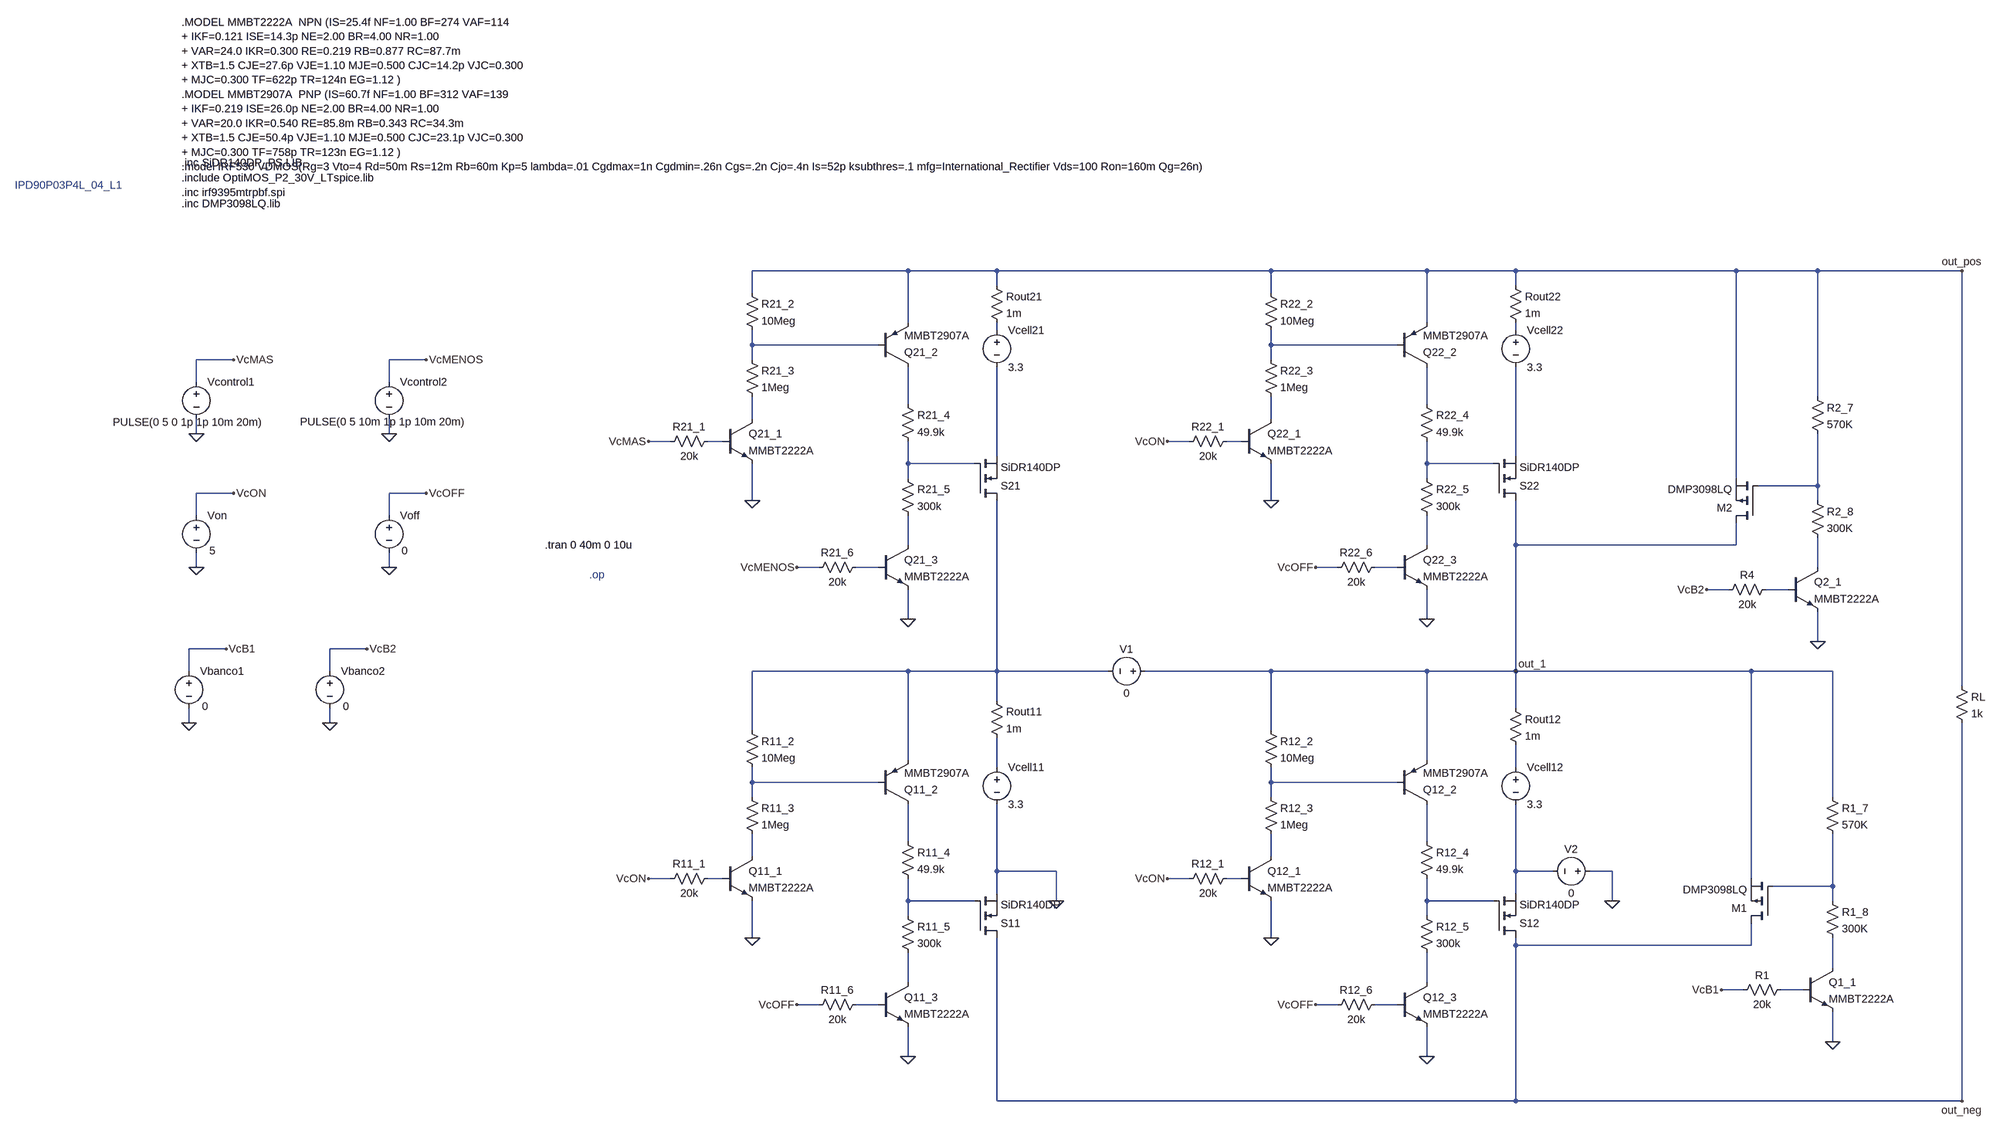
[diagram p0: schematic Switch Matriz_con pmos.asc]
Switch Matriz_con pmos.asc, the LTspice schematic file:
Version 4
SHEET 1 3872 1360
WIRE -592 -1232 -928 -1232
WIRE -400 -1232 -592 -1232
WIRE 192 -1232 -400 -1232
WIRE 528 -1232 192 -1232
WIRE 720 -1232 528 -1232
WIRE 1216 -1232 720 -1232
WIRE 1392 -1232 1216 -1232
WIRE 2800 -1232 1392 -1232
WIRE -400 -1200 -400 -1232
WIRE 720 -1200 720 -1232
WIRE -928 -1184 -928 -1232
WIRE 192 -1184 192 -1232
WIRE -592 -1120 -592 -1232
WIRE 528 -1120 528 -1232
WIRE -400 -1104 -400 -1120
WIRE 720 -1104 720 -1120
WIRE -928 -1072 -928 -1104
WIRE -656 -1072 -928 -1072
WIRE 192 -1072 192 -1104
WIRE 464 -1072 192 -1072
WIRE -2048 -1040 -2128 -1040
WIRE -1632 -1040 -1712 -1040
WIRE -928 -1040 -928 -1072
WIRE 192 -1040 192 -1072
WIRE -2128 -992 -2128 -1040
WIRE -1712 -992 -1712 -1040
WIRE 1392 -960 1392 -1232
WIRE -592 -944 -592 -1024
WIRE 528 -944 528 -1024
WIRE -928 -912 -928 -960
WIRE 192 -912 192 -960
WIRE -2128 -880 -2128 -912
WIRE -1712 -880 -1712 -912
WIRE -1104 -864 -1152 -864
WIRE -992 -864 -1024 -864
WIRE 16 -864 -32 -864
WIRE 128 -864 96 -864
WIRE -400 -832 -400 -1024
WIRE 720 -832 720 -1024
WIRE -592 -816 -592 -864
WIRE -448 -816 -592 -816
WIRE 528 -816 528 -864
WIRE 672 -816 528 -816
WIRE -592 -784 -592 -816
WIRE 528 -784 528 -816
WIRE 1216 -784 1216 -1232
WIRE 1392 -768 1392 -880
WIRE 1392 -768 1264 -768
WIRE -2048 -752 -2128 -752
WIRE -1632 -752 -1712 -752
WIRE -928 -736 -928 -816
WIRE 192 -736 192 -816
WIRE 1392 -736 1392 -768
WIRE -2128 -704 -2128 -752
WIRE -1712 -704 -1712 -752
WIRE -592 -640 -592 -704
WIRE 528 -640 528 -704
WIRE 720 -640 720 -736
WIRE 1216 -640 1216 -688
WIRE 1216 -640 720 -640
WIRE -2128 -592 -2128 -624
WIRE -1712 -592 -1712 -624
WIRE -784 -592 -832 -592
WIRE -656 -592 -704 -592
WIRE 336 -592 288 -592
WIRE 464 -592 416 -592
WIRE 1392 -592 1392 -656
WIRE 1200 -544 1152 -544
WIRE 1328 -544 1280 -544
WIRE -592 -480 -592 -544
WIRE 528 -480 528 -544
WIRE 1392 -432 1392 -496
WIRE -2064 -416 -2144 -416
WIRE -1760 -416 -1840 -416
WIRE -2144 -368 -2144 -416
WIRE -1840 -368 -1840 -416
WIRE -592 -368 -928 -368
WIRE -400 -368 -400 -736
WIRE -400 -368 -592 -368
WIRE -160 -368 -400 -368
WIRE 192 -368 -80 -368
WIRE 528 -368 192 -368
WIRE 720 -368 720 -640
WIRE 720 -368 528 -368
WIRE 1248 -368 720 -368
WIRE 1424 -368 1248 -368
WIRE 2800 -336 2800 -1232
WIRE -400 -304 -400 -368
WIRE 720 -288 720 -368
WIRE -2144 -256 -2144 -288
WIRE -1840 -256 -1840 -288
WIRE -928 -240 -928 -368
WIRE 192 -240 192 -368
WIRE -592 -176 -592 -368
WIRE 528 -176 528 -368
WIRE -400 -160 -400 -224
WIRE 720 -160 720 -208
WIRE -928 -128 -928 -160
WIRE -656 -128 -928 -128
WIRE 192 -128 192 -160
WIRE 464 -128 192 -128
WIRE -928 -96 -928 -128
WIRE 192 -96 192 -128
WIRE 1424 -96 1424 -368
WIRE -592 0 -592 -80
WIRE 528 0 528 -80
WIRE -928 32 -928 -16
WIRE 192 32 192 -16
WIRE -400 64 -400 -80
WIRE -272 64 -400 64
WIRE 720 64 720 -80
WIRE 800 64 720 64
WIRE 928 64 880 64
WIRE -1104 80 -1152 80
WIRE -992 80 -1024 80
WIRE 16 80 -32 80
WIRE 128 80 96 80
WIRE 1248 80 1248 -368
WIRE 1424 96 1424 -16
WIRE 1424 96 1296 96
WIRE -400 112 -400 64
WIRE 720 112 720 64
WIRE -592 128 -592 80
WIRE -448 128 -592 128
WIRE -272 128 -272 64
WIRE 528 128 528 80
WIRE 672 128 528 128
WIRE 928 128 928 64
WIRE 1424 128 1424 96
WIRE -592 160 -592 128
WIRE 528 160 528 128
WIRE -928 208 -928 128
WIRE 192 208 192 128
WIRE 720 224 720 208
WIRE 1248 224 1248 176
WIRE 1248 224 720 224
WIRE 1424 272 1424 208
WIRE -592 304 -592 240
WIRE 528 304 528 240
WIRE 1232 320 1184 320
WIRE 1360 320 1312 320
WIRE -784 352 -832 352
WIRE -656 352 -704 352
WIRE 336 352 288 352
WIRE 464 352 416 352
WIRE 1424 432 1424 368
WIRE -592 464 -592 400
WIRE 528 464 528 400
WIRE -400 560 -400 208
WIRE 720 560 720 224
WIRE 720 560 -400 560
WIRE 2800 560 2800 -256
WIRE 2800 560 720 560
FLAG -928 208 0
FLAG -592 464 0
FLAG -272 128 0
FLAG 192 208 0
FLAG 528 464 0
FLAG 928 128 0
FLAG -928 -736 0
FLAG -592 -480 0
FLAG 192 -736 0
FLAG 528 -480 0
FLAG -2128 -880 0
FLAG -1712 -880 0
FLAG -2048 -1040 VcMAS
FLAG -1632 -1040 VcMENOS
FLAG -1712 -592 0
FLAG -1632 -752 VcOFF
FLAG -2128 -592 0
FLAG -2048 -752 VcON
FLAG -832 352 VcOFF
FLAG -832 -592 VcMENOS
FLAG 288 -592 VcOFF
FLAG 288 352 VcOFF
FLAG -1152 80 VcON
FLAG -1152 -864 VcMAS
FLAG -32 -864 VcON
FLAG -32 80 VcON
FLAG 2800 -1232 out_pos
FLAG 2800 560 out_neg
FLAG 720 -368 out_1
FLAG 1424 432 0
FLAG 1184 320 VcB1
FLAG 1392 -432 0
FLAG 1152 -544 VcB2
FLAG -2064 -416 VcB1
FLAG -2144 -256 0
FLAG -1760 -416 VcB2
FLAG -1840 -256 0
SYMBOL npn -656 304 R0
SYMATTR InstName Q11_3
SYMATTR Value MMBT2222A
SYMBOL res -608 144 R0
SYMATTR InstName R11_5
SYMATTR Value 300k
SYMBOL res -608 -16 R0
SYMATTR InstName R11_4
SYMATTR Value 49.9k
SYMBOL npn -992 32 R0
SYMATTR InstName Q11_1
SYMATTR Value MMBT2222A
SYMBOL res -944 -112 R0
SYMATTR InstName R11_3
SYMATTR Value 1Meg
SYMBOL res -944 -256 R0
SYMATTR InstName R11_2
SYMATTR Value 10Meg
SYMBOL res -688 336 R90
WINDOW 0 0 56 VBottom 2
WINDOW 3 32 56 VTop 2
SYMATTR InstName R11_6
SYMATTR Value 20k
SYMBOL voltage -400 -176 R0
WINDOW 123 0 0 Left 0
WINDOW 39 0 0 Left 0
SYMATTR InstName Vcell11
SYMATTR Value 3.3
SYMBOL pnp -656 -80 M180
SYMATTR InstName Q11_2
SYMATTR Value MMBT2907A
SYMBOL nmos -448 208 M180
SYMATTR InstName S11
SYMATTR Value SiDR140DP
SYMATTR Prefix X
SYMBOL npn 464 304 R0
SYMATTR InstName Q12_3
SYMATTR Value MMBT2222A
SYMBOL res 512 144 R0
SYMATTR InstName R12_5
SYMATTR Value 300k
SYMBOL res 512 -16 R0
SYMATTR InstName R12_4
SYMATTR Value 49.9k
SYMBOL npn 128 32 R0
SYMATTR InstName Q12_1
SYMATTR Value MMBT2222A
SYMBOL res 176 -112 R0
SYMATTR InstName R12_3
SYMATTR Value 1Meg
SYMBOL res 176 -256 R0
SYMATTR InstName R12_2
SYMATTR Value 10Meg
SYMBOL res 432 336 R90
WINDOW 0 0 56 VBottom 2
WINDOW 3 32 56 VTop 2
SYMATTR InstName R12_6
SYMATTR Value 20k
SYMBOL voltage 720 -176 R0
WINDOW 123 0 0 Left 0
WINDOW 39 0 0 Left 0
SYMATTR InstName Vcell12
SYMATTR Value 3.3
SYMBOL pnp 464 -80 M180
SYMATTR InstName Q12_2
SYMATTR Value MMBT2907A
SYMBOL nmos 672 208 M180
SYMATTR InstName S12
SYMATTR Value SiDR140DP
SYMATTR Prefix X
SYMBOL npn -656 -640 R0
SYMATTR InstName Q21_3
SYMATTR Value MMBT2222A
SYMBOL res -608 -800 R0
SYMATTR InstName R21_5
SYMATTR Value 300k
SYMBOL res -608 -960 R0
SYMATTR InstName R21_4
SYMATTR Value 49.9k
SYMBOL npn -992 -912 R0
SYMATTR InstName Q21_1
SYMATTR Value MMBT2222A
SYMBOL res -944 -1056 R0
SYMATTR InstName R21_3
SYMATTR Value 1Meg
SYMBOL res -944 -1200 R0
SYMATTR InstName R21_2
SYMATTR Value 10Meg
SYMBOL res -688 -608 R90
WINDOW 0 0 56 VBottom 2
WINDOW 3 32 56 VTop 2
SYMATTR InstName R21_6
SYMATTR Value 20k
SYMBOL voltage -400 -1120 R0
WINDOW 123 0 0 Left 0
WINDOW 39 0 0 Left 0
SYMATTR InstName Vcell21
SYMATTR Value 3.3
SYMBOL pnp -656 -1024 M180
SYMATTR InstName Q21_2
SYMATTR Value MMBT2907A
SYMBOL nmos -448 -736 M180
SYMATTR InstName S21
SYMATTR Value SiDR140DP
SYMATTR Prefix X
SYMBOL npn 464 -640 R0
SYMATTR InstName Q22_3
SYMATTR Value MMBT2222A
SYMBOL res 512 -800 R0
SYMATTR InstName R22_5
SYMATTR Value 300k
SYMBOL res 512 -960 R0
SYMATTR InstName R22_4
SYMATTR Value 49.9k
SYMBOL npn 128 -912 R0
SYMATTR InstName Q22_1
SYMATTR Value MMBT2222A
SYMBOL res 176 -1056 R0
SYMATTR InstName R22_3
SYMATTR Value 1Meg
SYMBOL res 176 -1200 R0
SYMATTR InstName R22_2
SYMATTR Value 10Meg
SYMBOL res 432 -608 R90
WINDOW 0 0 56 VBottom 2
WINDOW 3 32 56 VTop 2
SYMATTR InstName R22_6
SYMATTR Value 20k
SYMBOL voltage 720 -1120 R0
WINDOW 123 0 0 Left 0
WINDOW 39 0 0 Left 0
SYMATTR InstName Vcell22
SYMATTR Value 3.3
SYMBOL pnp 464 -1024 M180
SYMATTR InstName Q22_2
SYMATTR Value MMBT2907A
SYMBOL nmos 672 -736 M180
SYMATTR InstName S22
SYMATTR Value SiDR140DP
SYMATTR Prefix X
SYMBOL voltage -2128 -1008 R0
WINDOW 3 -180 103 Left 2
WINDOW 123 0 0 Left 0
WINDOW 39 0 0 Left 0
SYMATTR Value PULSE(0 5 0 1p 1p 10m 20m)
SYMATTR InstName Vcontrol1
SYMBOL voltage -1712 -1008 R0
WINDOW 3 -192 102 Left 2
WINDOW 123 0 0 Left 0
WINDOW 39 0 0 Left 0
SYMATTR Value PULSE(0 5 10m 1p 1p 10m 20m)
SYMATTR InstName Vcontrol2
SYMBOL voltage -1712 -720 R0
WINDOW 3 27 92 Left 2
WINDOW 123 0 0 Left 0
WINDOW 39 0 0 Left 0
SYMATTR Value 0
SYMATTR InstName Voff
SYMBOL voltage -2128 -720 R0
WINDOW 3 28 92 Left 2
WINDOW 123 0 0 Left 0
WINDOW 39 0 0 Left 0
SYMATTR Value 5
SYMATTR InstName Von
SYMBOL res -1008 64 R90
WINDOW 0 0 56 VBottom 2
WINDOW 3 32 56 VTop 2
SYMATTR InstName R11_1
SYMATTR Value 20k
SYMBOL res -1008 -880 R90
WINDOW 0 0 56 VBottom 2
WINDOW 3 32 56 VTop 2
SYMATTR InstName R21_1
SYMATTR Value 20k
SYMBOL res 112 -880 R90
WINDOW 0 0 56 VBottom 2
WINDOW 3 32 56 VTop 2
SYMATTR InstName R22_1
SYMATTR Value 20k
SYMBOL res 112 64 R90
WINDOW 0 0 56 VBottom 2
WINDOW 3 32 56 VTop 2
SYMATTR InstName R12_1
SYMATTR Value 20k
SYMBOL res 2784 -352 R0
SYMATTR InstName RL
SYMATTR Value 1k
SYMBOL res 704 -304 R0
SYMATTR InstName Rout12
SYMATTR Value 1m
SYMBOL res -416 -320 R0
SYMATTR InstName Rout11
SYMATTR Value 1m
SYMBOL res -416 -1216 R0
SYMATTR InstName Rout21
SYMATTR Value 1m
SYMBOL res 704 -1216 R0
SYMATTR InstName Rout22
SYMATTR Value 1m
SYMBOL voltage -64 -368 R90
WINDOW 0 -32 56 VBottom 2
WINDOW 3 32 56 VTop 2
WINDOW 123 0 0 Left 0
WINDOW 39 0 0 Left 0
SYMATTR InstName V1
SYMATTR Value 0
SYMBOL voltage 896 64 R90
WINDOW 0 -32 56 VBottom 2
WINDOW 3 32 56 VTop 2
WINDOW 123 0 0 Left 0
WINDOW 39 0 0 Left 0
SYMATTR InstName V2
SYMATTR Value 0
SYMBOL npn 1360 272 R0
SYMATTR InstName Q1_1
SYMATTR Value MMBT2222A
SYMBOL res 1328 304 R90
WINDOW 0 0 56 VBottom 2
WINDOW 3 32 56 VTop 2
SYMATTR InstName R1
SYMATTR Value 20k
SYMBOL res 1408 112 R0
SYMATTR InstName R1_8
SYMATTR Value 300K
SYMBOL res 1408 -112 R0
SYMATTR InstName R1_7
SYMATTR Value 570K
SYMBOL npn 1328 -592 R0
SYMATTR InstName Q2_1
SYMATTR Value MMBT2222A
SYMBOL res 1296 -560 R90
WINDOW 0 0 56 VBottom 2
WINDOW 3 32 56 VTop 2
SYMATTR InstName R4
SYMATTR Value 20k
SYMBOL res 1376 -752 R0
SYMATTR InstName R2_8
SYMATTR Value 300K
SYMBOL res 1376 -976 R0
SYMATTR InstName R2_7
SYMATTR Value 570K
SYMBOL voltage -2144 -384 R0
WINDOW 3 28 92 Left 2
WINDOW 123 0 0 Left 0
WINDOW 39 0 0 Left 0
SYMATTR Value 0
SYMATTR InstName Vbanco1
SYMBOL voltage -1840 -384 R0
WINDOW 3 28 92 Left 2
WINDOW 123 0 0 Left 0
WINDOW 39 0 0 Left 0
SYMATTR Value 0
SYMATTR InstName Vbanco2
SYMBOL pmos 1296 176 R180
SYMATTR InstName M1
SYMATTR Value DMP3098LQ
SYMATTR Prefix X
SYMBOL pmos 1264 -688 R180
SYMATTR InstName M2
SYMATTR Value DMP3098LQ
SYMATTR Prefix X
TEXT -1376 -640 Left 2 !.tran 0 40m 0 10u
TEXT -2160 -1784 Left 2 !.MODEL MMBT2222A  NPN (IS=25.4f NF=1.00 BF=274 VAF=114 \n+ IKF=0.121 ISE=14.3p NE=2.00 BR=4.00 NR=1.00 \n+ VAR=24.0 IKR=0.300 RE=0.219 RB=0.877 RC=87.7m \n+ XTB=1.5 CJE=27.6p VJE=1.10 MJE=0.500 CJC=14.2p VJC=0.300 \n+ MJC=0.300 TF=622p TR=124n EG=1.12 )\n.MODEL MMBT2907A  PNP (IS=60.7f NF=1.00 BF=312 VAF=139 \n+ IKF=0.219 ISE=26.0p NE=2.00 BR=4.00 NR=1.00 \n+ VAR=20.0 IKR=0.540 RE=85.8m RB=0.343 RC=34.3m \n+ XTB=1.5 CJE=50.4p VJE=1.10 MJE=0.500 CJC=23.1p VJC=0.300 \n+ MJC=0.300 TF=758p TR=123n EG=1.12 )\n.model IRF530 VDMOS(Rg=3 Vto=4 Rd=50m Rs=12m Rb=60m Kp=5 lambda=.01 Cgdmax=1n Cgdmin=.26n Cgs=.2n Cjo=.4n Is=52p ksubthres=.1 mfg=International_Rectifier Vds=100 Ron=160m Qg=26n)
TEXT -2160 -1480 Left 2 !.inc SiDR140DP_PS.LIB
TEXT -1280 -576 Left 2 ;.op
TEXT -2160 -1448 Left 2 !.include OptiMOS_P2_30V_LTspice.lib
TEXT -2520 -1432 Left 2 ;IPD90P03P4L_04_L1
TEXT -2160 -1416 Left 2 !.inc irf9395mtrpbf.spi
TEXT -2160 -1392 Left 2 !.inc DMP3098LQ.lib

The netlist it stands for:
* Switch Matriz_con pmos.asc
Q11_3 N038 N041 0 0 MMBT2222A
R11_5 N035 N038 300k
R11_4 N027 N035 49.9k
Q11_1 N029 N032 0 0 MMBT2222A
R11_3 N025 N029 1Meg
R11_2 N022 N025 10Meg
R11_6 N041 VcOFF 20k
Vcell11 N023 0 3.3
Q11_2 N027 N025 N022 0 MMBT2907A
XS11 out_neg N035 0 SiDR140DP  ; pins D G S
Q12_3 N039 N042 0 0 MMBT2222A
R12_5 N036 N039 300k
R12_4 N028 N036 49.9k
Q12_1 N030 N033 0 0 MMBT2222A
R12_3 N026 N030 1Meg
R12_2 out_1 N026 10Meg
R12_6 N042 VcOFF 20k
Vcell12 N024 N031 3.3
Q12_2 N028 N026 out_1 0 MMBT2907A
XS12 out_neg N036 N031 SiDR140DP  ; pins D G S
Q21_3 N016 N018 0 0 MMBT2222A
R21_5 N013 N016 300k
R21_4 N005 N013 49.9k
Q21_1 N007 N009 0 0 MMBT2222A
R21_3 N003 N007 1Meg
R21_2 out_pos N003 10Meg
R21_6 N018 VcMENOS 20k
Vcell21 N001 N011 3.3
Q21_2 N005 N003 out_pos 0 MMBT2907A
XS21 N022 N013 N011 SiDR140DP  ; pins D G S
Q22_3 N017 N019 0 0 MMBT2222A
R22_5 N014 N017 300k
R22_4 N006 N014 49.9k
Q22_1 N008 N010 0 0 MMBT2222A
R22_3 N004 N008 1Meg
R22_2 out_pos N004 10Meg
R22_6 N019 VcOFF 20k
Vcell22 N002 N012 3.3
Q22_2 N006 N004 out_pos 0 MMBT2907A
XS22 out_1 N014 N012 SiDR140DP  ; pins D G S
Vcontrol1 VcMAS 0 PULSE(0 5 0 1p 1p 10m 20m)
Vcontrol2 VcMENOS 0 PULSE(0 5 10m 1p 1p 10m 20m)
Voff VcOFF 0 0
Von VcON 0 5
R11_1 N032 VcON 20k
R21_1 N009 VcMAS 20k
R22_1 N010 VcON 20k
R12_1 N033 VcON 20k
RL out_pos out_neg 1k
Rout12 out_1 N024 1m
Rout11 N022 N023 1m
Rout21 out_pos N001 1m
Rout22 out_pos N002 1m
V1 out_1 N022 0
V2 0 N031 0
Q1_1 N037 N040 0 0 MMBT2222A
R1 N040 VcB1 20k
R1_8 N034 N037 300K
R1_7 out_1 N034 570K
Q2_1 N020 N021 0 0 MMBT2222A
R4 N021 VcB2 20k
R2_8 N015 N020 300K
R2_7 out_pos N015 570K
Vbanco1 VcB1 0 0
Vbanco2 VcB2 0 0
XM1 out_neg N034 out_1 DMP3098LQ  ; pins D G S
XM2 out_1 N015 out_pos DMP3098LQ  ; pins D G S
.model NPN NPN
.model PNP PNP
.lib standard.bjt
.tran 0 40m 0 10u
.MODEL MMBT2222A  NPN (IS=25.4f NF=1.00 BF=274 VAF=114
+ IKF=0.121 ISE=14.3p NE=2.00 BR=4.00 NR=1.00
+ VAR=24.0 IKR=0.300 RE=0.219 RB=0.877 RC=87.7m
+ XTB=1.5 CJE=27.6p VJE=1.10 MJE=0.500 CJC=14.2p VJC=0.300
+ MJC=0.300 TF=622p TR=124n EG=1.12 )
.MODEL MMBT2907A  PNP (IS=60.7f NF=1.00 BF=312 VAF=139
+ IKF=0.219 ISE=26.0p NE=2.00 BR=4.00 NR=1.00
+ VAR=20.0 IKR=0.540 RE=85.8m RB=0.343 RC=34.3m
+ XTB=1.5 CJE=50.4p VJE=1.10 MJE=0.500 CJC=23.1p VJC=0.300
+ MJC=0.300 TF=758p TR=123n EG=1.12 )
.model IRF530 VDMOS(Rg=3 Vto=4 Rd=50m Rs=12m Rb=60m Kp=5 lambda=.01 Cgdmax=1n Cgdmin=.26n Cgs=.2n Cjo=.4n Is=52p ksubthres=.1 mfg=International_Rectifier Vds=100 Ron=160m Qg=26n)
.inc SiDR140DP_PS.LIB
* .op
.include OptiMOS_P2_30V_LTspice.lib
* IPD90P03P4L_04_L1
.inc irf9395mtrpbf.spi
.inc DMP3098LQ.lib
.backanno
.end